# EAGLE design unidirectional-low-voltage-level-converter-array (EAGLE 6.5.0)
AUTHOR: Pat Pannuto; REV: A; TITLE: unidirectional-low-voltage-level-converter-array
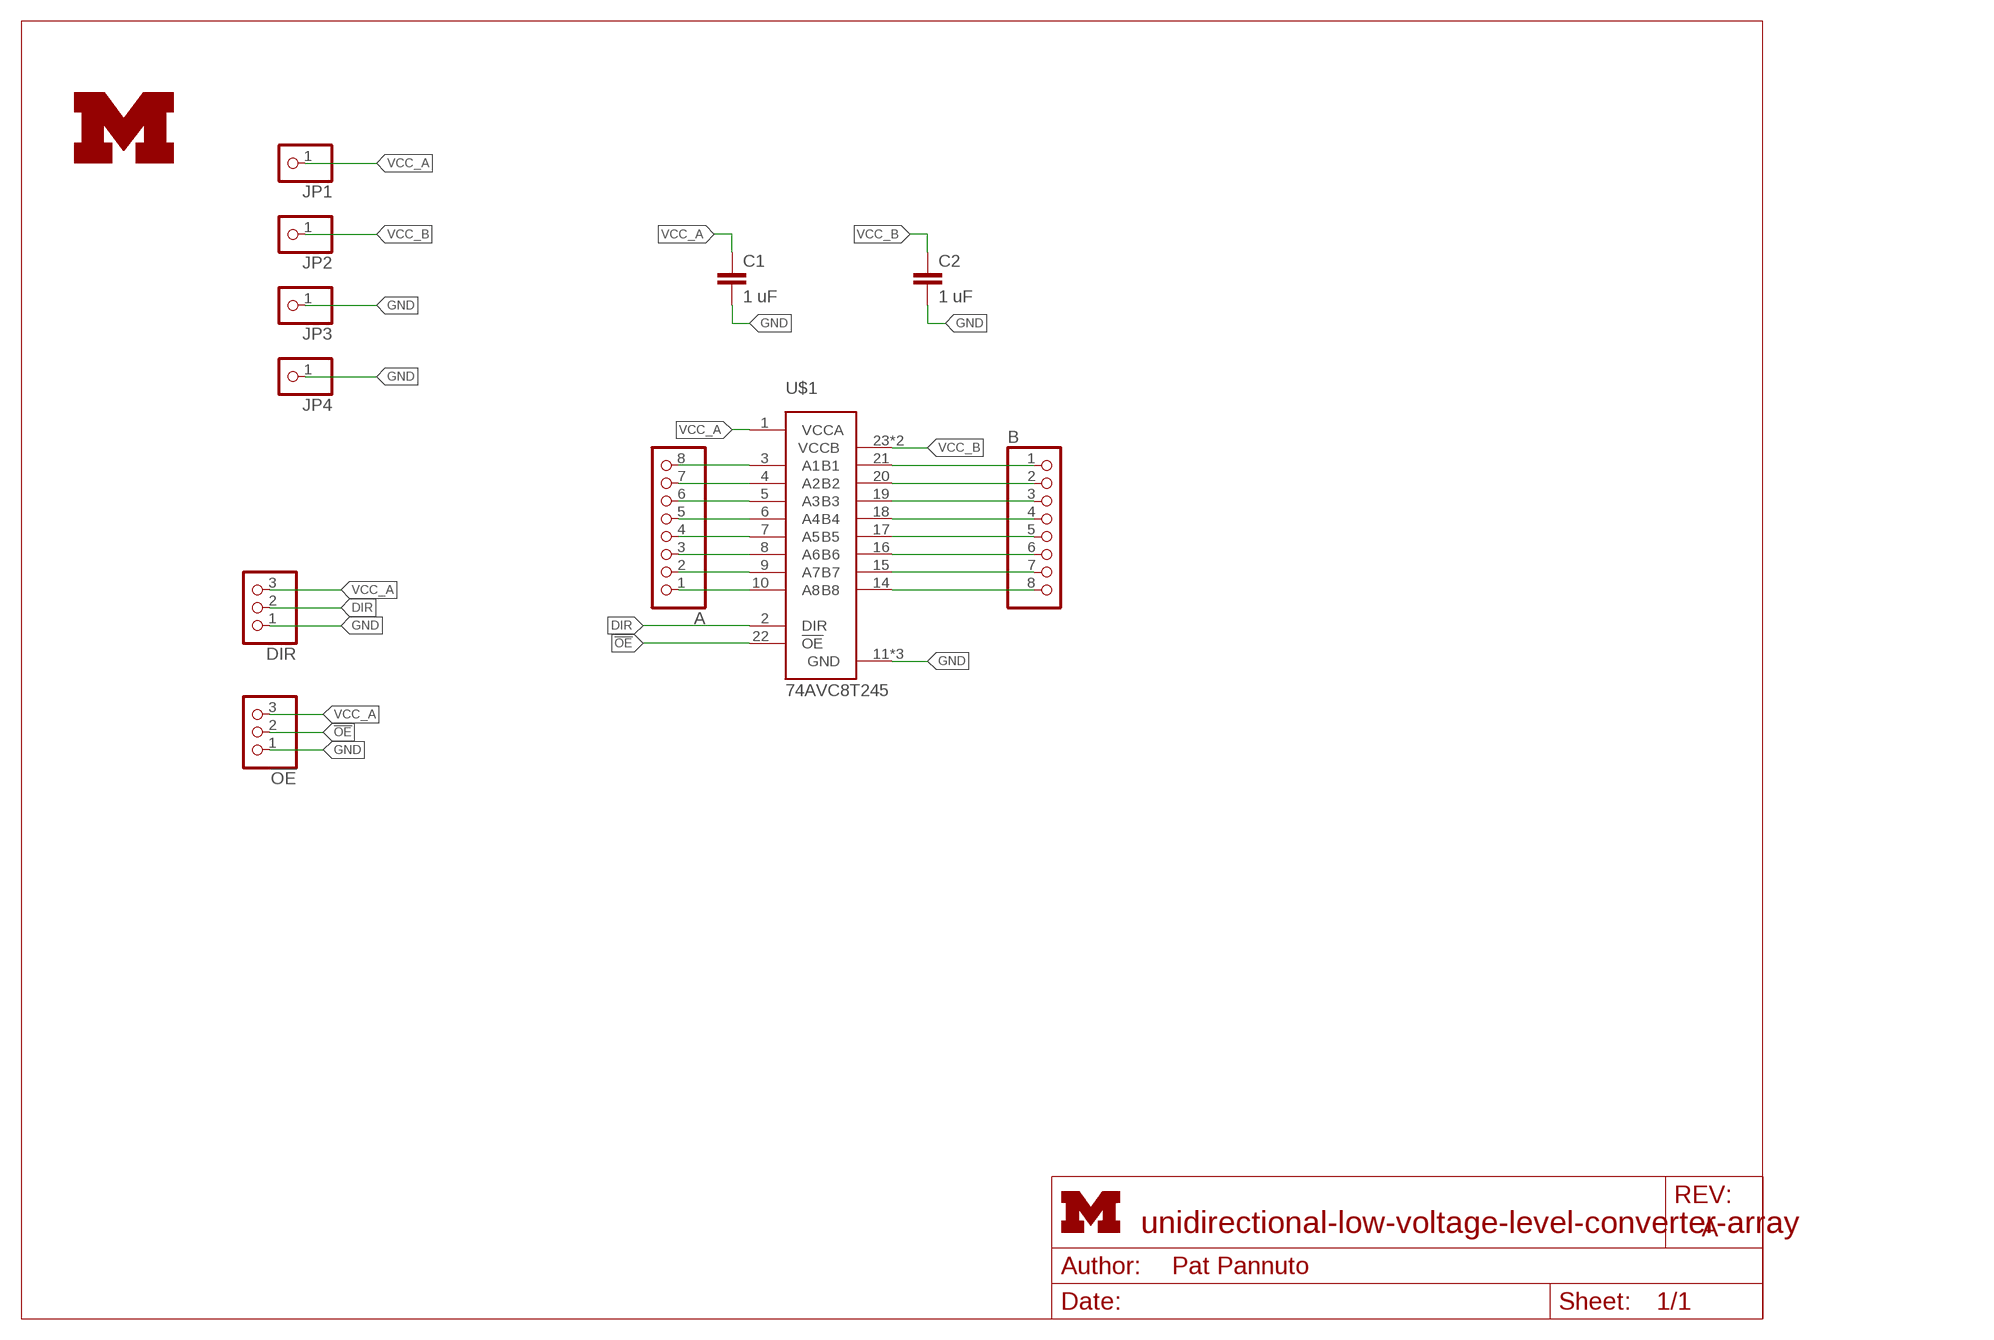
[diagram p0: schematic, sheet 1]
FRAME1 (LETTER_L): HEIGHT: 8.5in; WIDTH: 11in

## Parts
!OE  PINHD-1X3  [1X03]
A  PINHD-1X8  [1X08]
B  PINHD-1X8  [1X08]
C1  1 uF  C-EUC0603  [C0603]
C2  1 uF  C-EUC0603  [C0603]
DIR  PINHD-1X3  [1X03]
JP1  PINHD-1X1  [1X01]
JP2  PINHD-1X1  [1X01]
JP3  PINHD-1X1  [1X01]
JP4  PINHD-1X1  [1X01]
LOGO1  UMICH_SOLID_SMALL+  [UMICH_SOLID_100MIL]
U$1  74AVC8T245  [TSSOP24]

## Nets
!OE: !OE.2 U$1.22(!OE)
A1: A.8 U$1.3(A1)
A2: A.7 U$1.4(A2)
A3: A.6 U$1.5(A3)
A4: A.5 U$1.6(A4)
A5: A.4 U$1.7(A5)
A6: A.3 U$1.8(A6)
A7: A.2 U$1.9(A7)
A8: A.1 U$1.10(A8)
B1: B.1 U$1.21(B1)
B2: B.2 U$1.20(B2)
B3: B.3 U$1.19(B3)
B4: B.4 U$1.18(B4)
B5: B.5 U$1.17(B5)
B6: B.6 U$1.16(B6)
B7: B.7 U$1.15(B7)
B8: B.8 U$1.14(B8)
DIR: DIR.2 U$1.2(DIR)
GND: !OE.1 C1.2 C2.2 DIR.1 JP3.1 JP4.1 U$1.11(GND) U$1.12(GND) U$1.13(GND)
VCC_A: !OE.3 C1.1 DIR.3 JP1.1 U$1.1(VCCA)
VCC_B: C2.1 JP2.1 U$1.23(VCCB) U$1.24(VCCB)

## Library data of the parts
!OE DIR = pinhead:PINHD-1X3: PIN HEADER
A B = pinhead:PINHD-1X8: PIN HEADER
C1 C2 = resistor:C-EU: CAPACITOR, European symbol
JP1-JP4 = pinhead:PINHD-1X1: PIN HEADER
LOGO1 = logos:UMICH_SOLID
U$1 = breakouts:74AVC8T245; DIGIKEY: 568-4754-1-ND

## Board
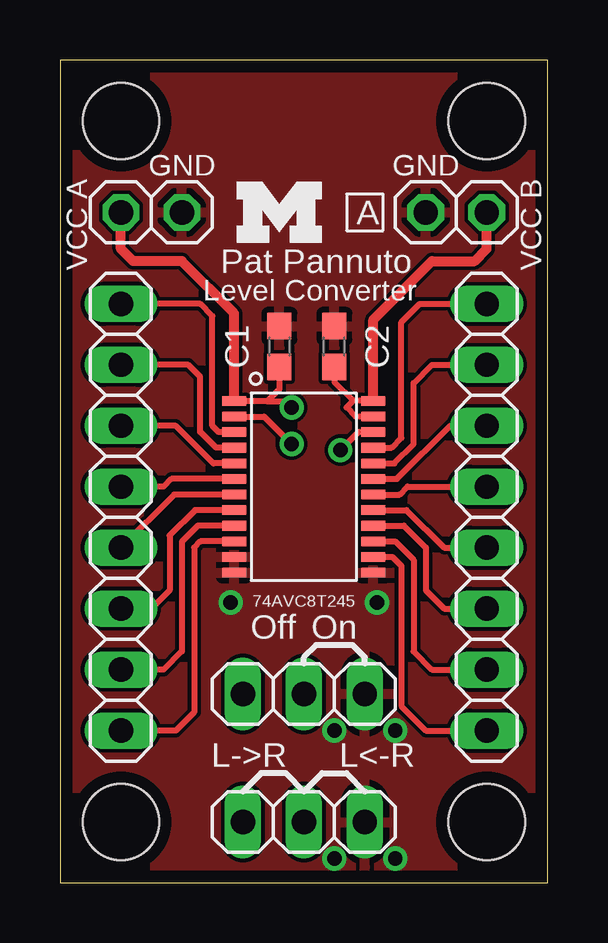
[diagram p1: board, top side]
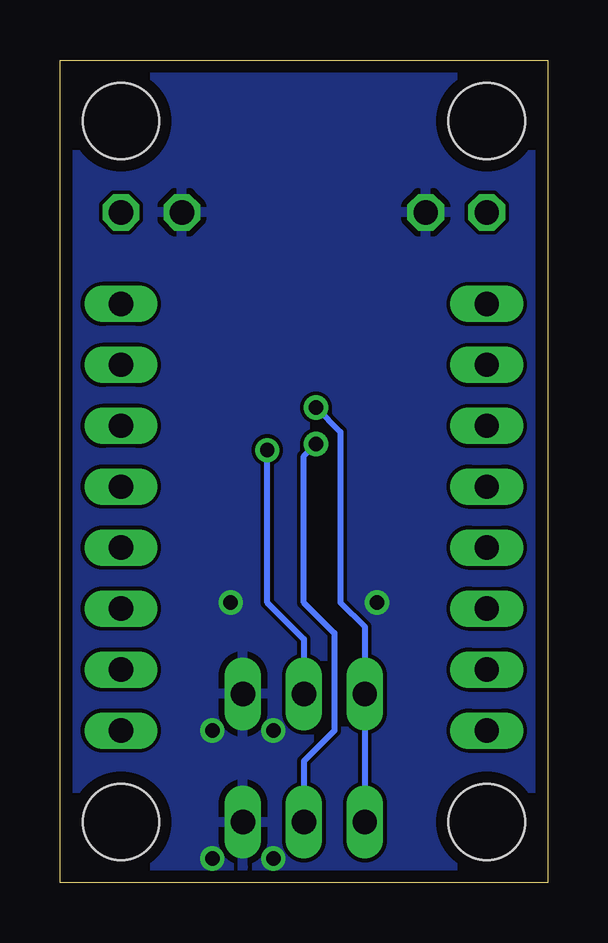
[diagram p2: board, bottom side, seen from below]

Size 20.32 x 34.29 mm. Coordinates in mm from the lower left corner, seen from the top.
Outline: 0,0 20.32,0 20.32,34.29 0,34.29 0,0
Copper layers (1*16): Top 0.0178mm / dielectric 59mil / Bottom 0.0178mm
Design rules "sunstone-2lyr_v1.0.0.3": minimum track width 6mil, minimum drill 14mil, track to track 6mil, track to pad 6mil, pad to pad 6mil, via to via 6mil, smd to smd 6mil, copper to edge 20mil, drill to drill 16mil, minimum pad ring 8mil, minimum via ring 8mil, stop-mask expansion 3mil, vias tented up to drill 0mil, thermal gap 10mil
Holes 3.17 mm at 2.54,31.75 17.78,31.75 2.54,2.54 17.78,2.54

### Footprints (pad centres in the part's own frame; a part is rotated, then mirrored left to right if it is on the bottom)
1X03 = drill 1.016 long: 1 -2.54,0; 2 0,0; 3 2.54,0
1X08 = drill 1.016 long: 1 -8.89,0; 2 -6.35,0; 3 -3.81,0; 4 -1.27,0; 5 1.27,0; 6 3.81,0; 7 6.35,0; 8 8.89,0
C0603 = smd 1.1 x 1: 1 -0.85,0; 2 0.85,0
1X01 = drill 1.016 octagon: 1 0,0
TSSOP24 = smd 0.4 x 1: 1 -3.575,-2.9; 2 -2.925,-2.9; 3 -2.275,-2.9; 4 -1.625,-2.9; 5 -0.975,-2.9; 6 -0.325,-2.9; 7 0.325,-2.9; 8 0.975,-2.9; 9 1.625,-2.9; 10 2.275,-2.9; 11 2.925,-2.9; 12 3.575,-2.9; 13 3.575,2.9; 14 2.925,2.9; 15 2.275,2.9; 16 1.625,2.9; 17 0.975,2.9; 18 0.325,2.9; 19 -0.325,2.9; 20 -0.975,2.9; 21 -1.625,2.9; 22 -2.275,2.9; 23 -2.925,2.9; 24 -3.575,2.9

### Placement (x,y rotation side)
!OE  10.16,7.87 180 top
A  2.54,15.24 90 top
B  17.78,15.24 270 top
C1  9.14,22.35 90 top
C2  11.43,22.35 90 top
DIR  10.16,2.54 180 top
JP1  2.54,27.94 0 top
JP2  17.78,27.94 0 top
JP3  5.08,27.94 0 top
JP4  15.24,27.94 0 top
LOGO1  7.37,26.67 0 top
U$1  10.16,16.51 270 top

### Tracks (layer width: path | path; a pad name or v marks a point on that pad's centre or on a via)
!OE  (via drill 0.6)
  Top 0.254: U$1.22 12.44,18.79 v11.68,18.03
  Bottom 0.254: v11.68,18.03 11.68,11.68 10.16,10.16 !OE.2
A1
  Top 0.254: U$1.3 6.62,18.79 6.35,19.05 6.35,23.62 5.84,24.13 A.8
A2
  Top 0.254: U$1.4 6.5,18.14 5.84,18.8 5.84,21.08 5.33,21.59 A.7
A3
  Top 0.254: U$1.5 6.39,17.48 4.83,19.05 A.6
A4
  Top 0.254: U$1.6 4.64,16.84 4.32,16.51 A.5
A5
  Top 0.254: U$1.7 4.75,16.18 A.4
A6
  Top 0.254: U$1.8 5.63,15.54 4.57,14.48 4.57,12.19 3.81,11.43 A.3
A7
  Top 0.254: U$1.9 5.74,14.88 5.08,14.22 5.08,9.65 4.32,8.89 A.2
A8
  Top 0.254: U$1.10 5.85,14.23 5.59,13.97 5.59,7.11 4.83,6.35 A.1
B1
  Top 0.254: U$1.21 13.82,18.14 14.22,18.54 14.22,23.37 14.99,24.13 B.1
B2
  Top 0.254: U$1.20 13.93,17.48 14.73,18.29 14.73,20.83 15.49,21.59 B.2
B3
  Top 0.254: U$1.19 14.04,16.84 16.26,19.05 B.3
B4
  Top 0.254: U$1.18 14.15,16.18 14.48,16.51 B.4
B5
  Top 0.254: U$1.17 14.44,15.54 16,13.97 B.5
B6
  Top 0.254: U$1.16 14.32,14.88 15.24,13.97 15.24,12.19 16,11.43 B.6
B7
  Top 0.254: U$1.15 13.96,14.23 14.73,13.46 14.73,9.65 15.49,8.89 B.7
B8
  Top 0.254: U$1.14 13.85,13.59 14.22,13.21 14.22,7.37 15.24,6.35 B.8
DIR  (via drill 0.6)
  Top 0.254: U$1.2 8.51,19.43 v9.65,18.29
  Bottom 0.254: DIR.2 10.16,5.08 8.89,6.35 8.89,10.41 10.16,11.68 10.16,17.78 v9.65,18.29
GND  (via drill 0.6)
  other vias: 11.43,6.35 11.43,1.02 13.97,6.35 13.97,1.02 7.11,11.68 13.21,11.68
  pour Top: -2.54,35.56 -2.54,-1.27 22.86,-1.27 22.86,35.56
  pour Bottom: -1.27,36.83 -1.27,-2.54 21.59,-2.54 21.59,36.83
VCC_A  (via drill 0.6)
  Top 0.254: C1.1 9.14,20.57 8.64,20.07 | 8.64,20.07 7.28,20.07 U$1.1 | 8.64,20.07 9.4,20.07 v9.65,19.81
  Top 0.406: U$1.1 7.26,23.73 5.08,25.91 3.05,25.91 2.54,26.42 JP1.1
  Bottom 0.254: v9.65,19.81 8.64,18.8 8.64,11.68 7.62,10.67 !OE.3 DIR.3
VCC_B
  Top 0.254: U$1.23 12.31,19.43 11.94,19.81 12.21,20.09 | U$1.24 12.21,20.09 | C2.1 11.43,20.87 12.21,20.09
  Top 0.406: U$1.24 13.06,23.47 15.49,25.91 17.27,25.91 17.78,26.42 JP2.1

### Text on the board
tPlace: GND | GND | A | VCC A | VCC B | Pat Pannuto | Level Converter | Off | On | L->R | L<-R